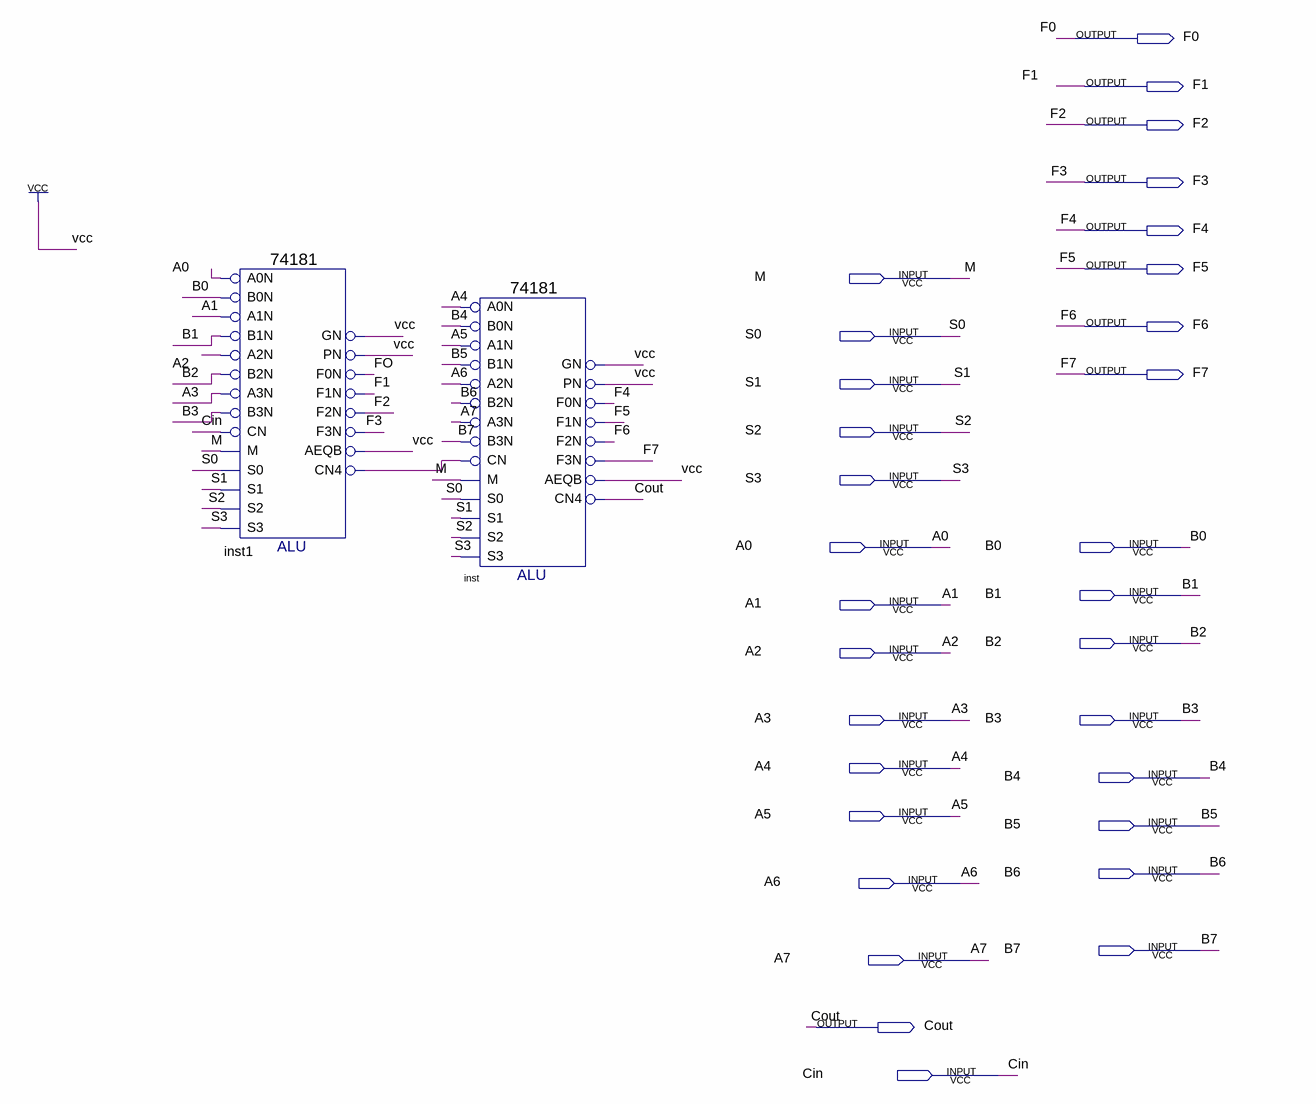
[diagram p0: schematic sheet]
// Quartus schematic ALU.bdf as structural Verilog: 2 symbols, 31 pins
module ALU (
  input  M,
  input  S0,
  input  S1,
  input  S2,
  input  S3,
  input  A0,
  input  B0,
  input  B1,
  input  A1,
  input  B2,
  input  A2,
  input  A3,
  input  B3,
  input  A4,
  input  B4,
  input  A5,
  input  B5,
  input  B6,
  input  A6,
  input  B7,
  input  A7,
  input  Cin,
  output F0,
  output F1,
  output F2,
  output F3,
  output F4,
  output F5,
  output F6,
  output F7,
  output Cout
);

  wire FO, inst1_cn4, vcc;

  \74181  inst1 (
    .B0N(B0), .A0N(A0), .A1N(A1), .B1N(B1), .A3N(A3), .B2N(B2), .A2N(A2), .M(M), .CN(Cin), .B3N(B3), .S2(S2),
    .S1(S1), .S0(S0), .S3(S3), .PN(vcc), .GN(vcc), .F3N(F3), .F1N(F1), .F0N(FO), .AEQB(vcc), .CN4(inst1_cn4),
    .F2N(F2));
  \74181  inst (
    .B0N(B4), .A0N(A4), .A1N(A5), .B1N(B5), .A3N(A7), .B2N(B6), .A2N(A6), .M(M), .CN(inst1_cn4), .B3N(B7),
    .S2(S2), .S1(S1), .S0(S0), .S3(S3), .PN(vcc), .GN(vcc), .F3N(F7), .F1N(F5), .F0N(F4), .AEQB(vcc),
    .CN4(Cout), .F2N(F6));
  // also tied to VCC on the sheet: vcc
endmodule
